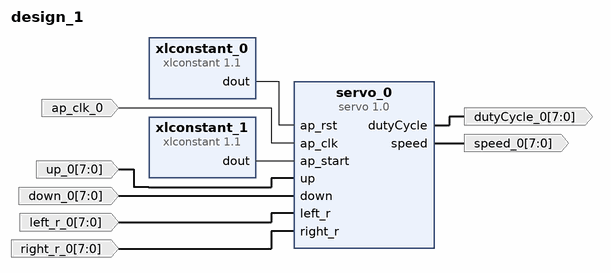
[diagram p0: block diagram of the top level]
# Vivado block design design_1, xc7z020clg484-1, Vivado 2019.2
create_bd_design design_1

create_bd_port -dir I -from 7 -to 0 -type data left_r_0
create_bd_port -dir I -from 7 -to 0 -type data down_0
create_bd_port -dir I -from 7 -to 0 -type data up_0
create_bd_port -dir O -from 7 -to 0 -type data speed_0
create_bd_port -dir O -from 7 -to 0 -type data dutyCycle_0
create_bd_port -dir I -from 7 -to 0 -type data right_r_0
create_bd_port -dir I -type clk ap_clk_0

create_bd_cell -type ip -vlnv xilinx.com:ip:xlconstant:1.1 xlconstant_0
set_property -dict {CONFIG.CONST_VAL 0} [get_bd_cells xlconstant_0]
create_bd_cell -type ip -vlnv xilinx.com:ip:xlconstant:1.1 xlconstant_1
create_bd_cell -type ip -vlnv xilinx.com:hls:servo:1.0 servo_0

# ---- connections ----

connect_bd_net [get_bd_pins xlconstant_0/dout] [get_bd_pins servo_0/ap_rst]
connect_bd_net [get_bd_pins servo_0/speed] [get_bd_ports speed_0]
connect_bd_net [get_bd_pins servo_0/dutyCycle] [get_bd_ports dutyCycle_0]
connect_bd_net -net ap_clk_0_1 [get_bd_ports ap_clk_0] [get_bd_pins servo_0/ap_clk]
connect_bd_net [get_bd_pins xlconstant_1/dout] [get_bd_pins servo_0/ap_start]
connect_bd_net -net up_0_1 [get_bd_ports up_0] [get_bd_pins servo_0/up]
connect_bd_net -net down_0_1 [get_bd_ports down_0] [get_bd_pins servo_0/down]
connect_bd_net -net left_r_0_1 [get_bd_ports left_r_0] [get_bd_pins servo_0/left_r]
connect_bd_net -net right_r_0_1 [get_bd_ports right_r_0] [get_bd_pins servo_0/right_r]

validate_bd_design
save_bd_design
